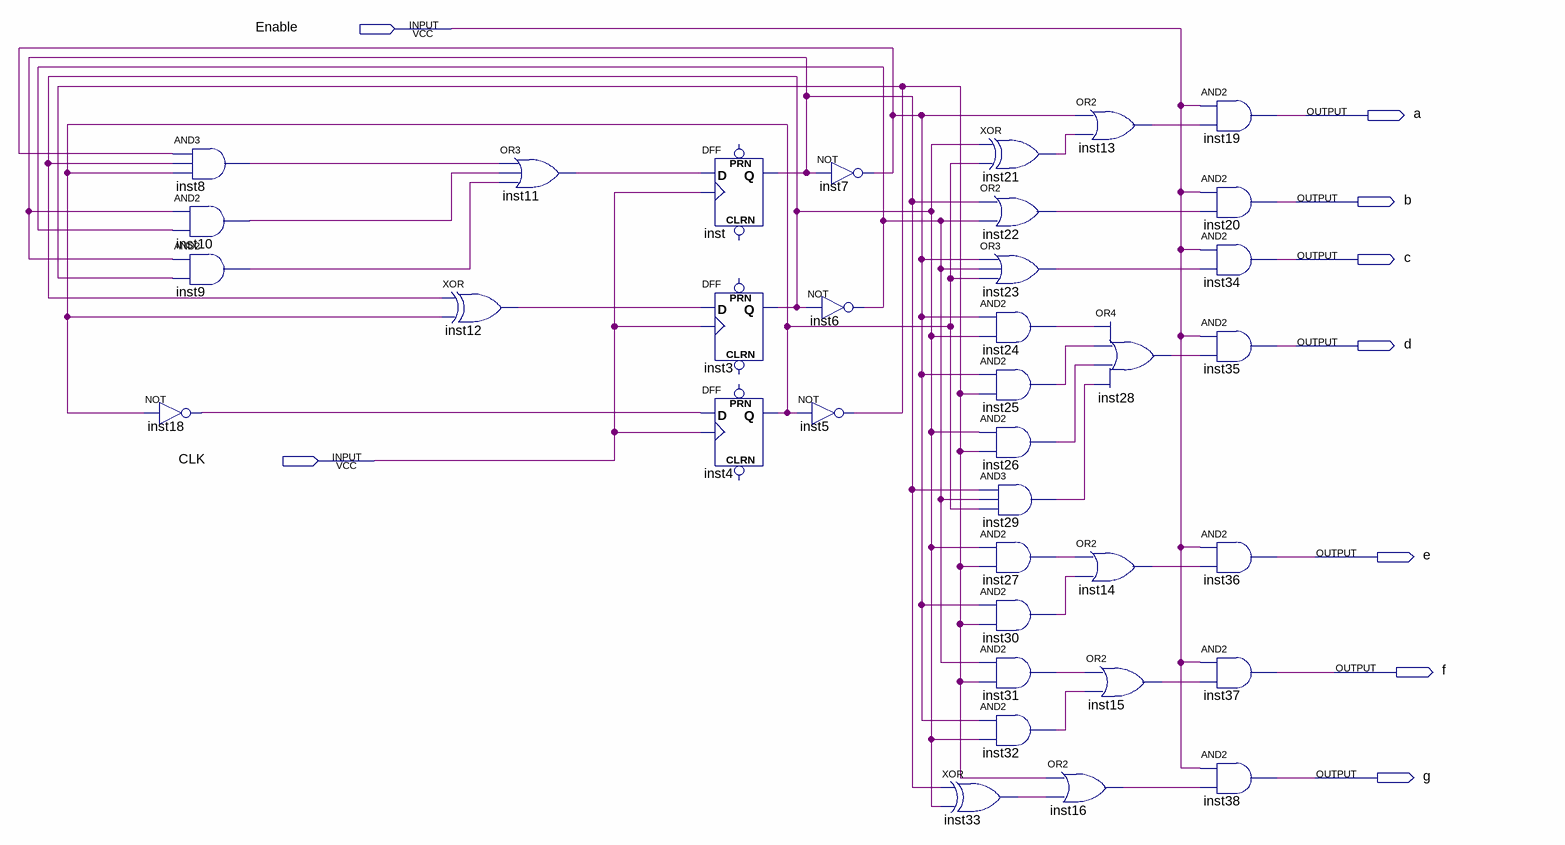
[diagram p0: schematic sheet]
// Quartus schematic RED_FND.bdf as structural Verilog: 36 symbols, 9 pins
module RED_FND (
  input  Enable,
  input  CLK,
  output a,
  output b,
  output c,
  output d,
  output e,
  output f,
  output g
);

  wire inst3_q, inst4_q, inst5_out, inst6_out, inst7_out, inst8_out, inst9_out, inst10_out, inst11_out,
       inst12_out, inst13_out, inst14_out, inst15_out, inst16_out, inst18_out, inst21_out, inst22_out,
       inst23_out, inst24_out, inst25_out, inst26_out, inst27_out, inst28_out, inst29_out, inst30_out,
       inst31_out, inst32_out, inst33_out, inst_q;

  and inst8 (inst8_out, inst7_out, inst3_q, inst4_q);
  and inst10 (inst10_out, inst_q, inst6_out);
  and inst9 (inst9_out, inst_q, inst5_out);
  not inst18 (inst18_out, inst4_q);
  xor inst12 (inst12_out, inst3_q, inst4_q);
  or inst11 (inst11_out, inst8_out, inst10_out, inst9_out);
  DFF inst (.CLK(CLK), .D(inst11_out), .Q(inst_q));  // open: CLRN, PRN
  DFF inst3 (.CLK(CLK), .D(inst12_out), .Q(inst3_q));  // open: CLRN, PRN
  DFF inst4 (.CLK(CLK), .D(inst18_out), .Q(inst4_q));  // open: CLRN, PRN
  not inst7 (inst7_out, inst_q);
  not inst6 (inst6_out, inst3_q);
  not inst5 (inst5_out, inst4_q);
  xor inst33 (inst33_out, inst_q, inst3_q);
  xor inst21 (inst21_out, inst3_q, inst4_q);
  or inst22 (inst22_out, inst_q, inst6_out);
  or inst23 (inst23_out, inst7_out, inst6_out, inst4_q);
  and inst24 (inst24_out, inst7_out, inst3_q);
  and inst25 (inst25_out, inst7_out, inst5_out);
  and inst26 (inst26_out, inst3_q, inst5_out);
  and inst29 (inst29_out, inst_q, inst6_out, inst4_q);
  and inst27 (inst27_out, inst3_q, inst5_out);
  and inst30 (inst30_out, inst7_out, inst5_out);
  and inst31 (inst31_out, inst6_out, inst5_out);
  and inst32 (inst32_out, inst7_out, inst3_q);
  or inst13 (inst13_out, inst7_out, inst21_out);
  or inst28 (inst28_out, inst24_out, inst25_out, inst26_out, inst29_out);
  or inst14 (inst14_out, inst27_out, inst30_out);
  or inst15 (inst15_out, inst31_out, inst32_out);
  or inst16 (inst16_out, inst5_out, inst33_out);
  and inst19 (a, Enable, inst13_out);
  and inst20 (b, Enable, inst22_out);
  and inst34 (c, Enable, inst23_out);
  and inst35 (d, Enable, inst28_out);
  and inst36 (e, Enable, inst14_out);
  and inst37 (f, Enable, inst15_out);
  and inst38 (g, Enable, inst16_out);
endmodule
